# EasyEDA Pro project ProPrj_NavBot-ES02.epro, schematic MAIN

## Sheets
1 P1: Assembly Variant: Basic; Board Name: MAIN; Create Date: 2025-09-18; Page Name: P1; Project Name: NavBot-ES02; Schematic Name: MAIN; Update Date: 2025-10-18; BladeWidth: 10; Company: NavBot; Drawed: Xiaole; Page Size: A4; RegionStart: 1; Reviewed: Xiaole; ShowBorder: 1; TitleBlock: 1; TitleBlockPosition: 3; Version: V1.0; XRegionCount: 6; YRegionCount: 4
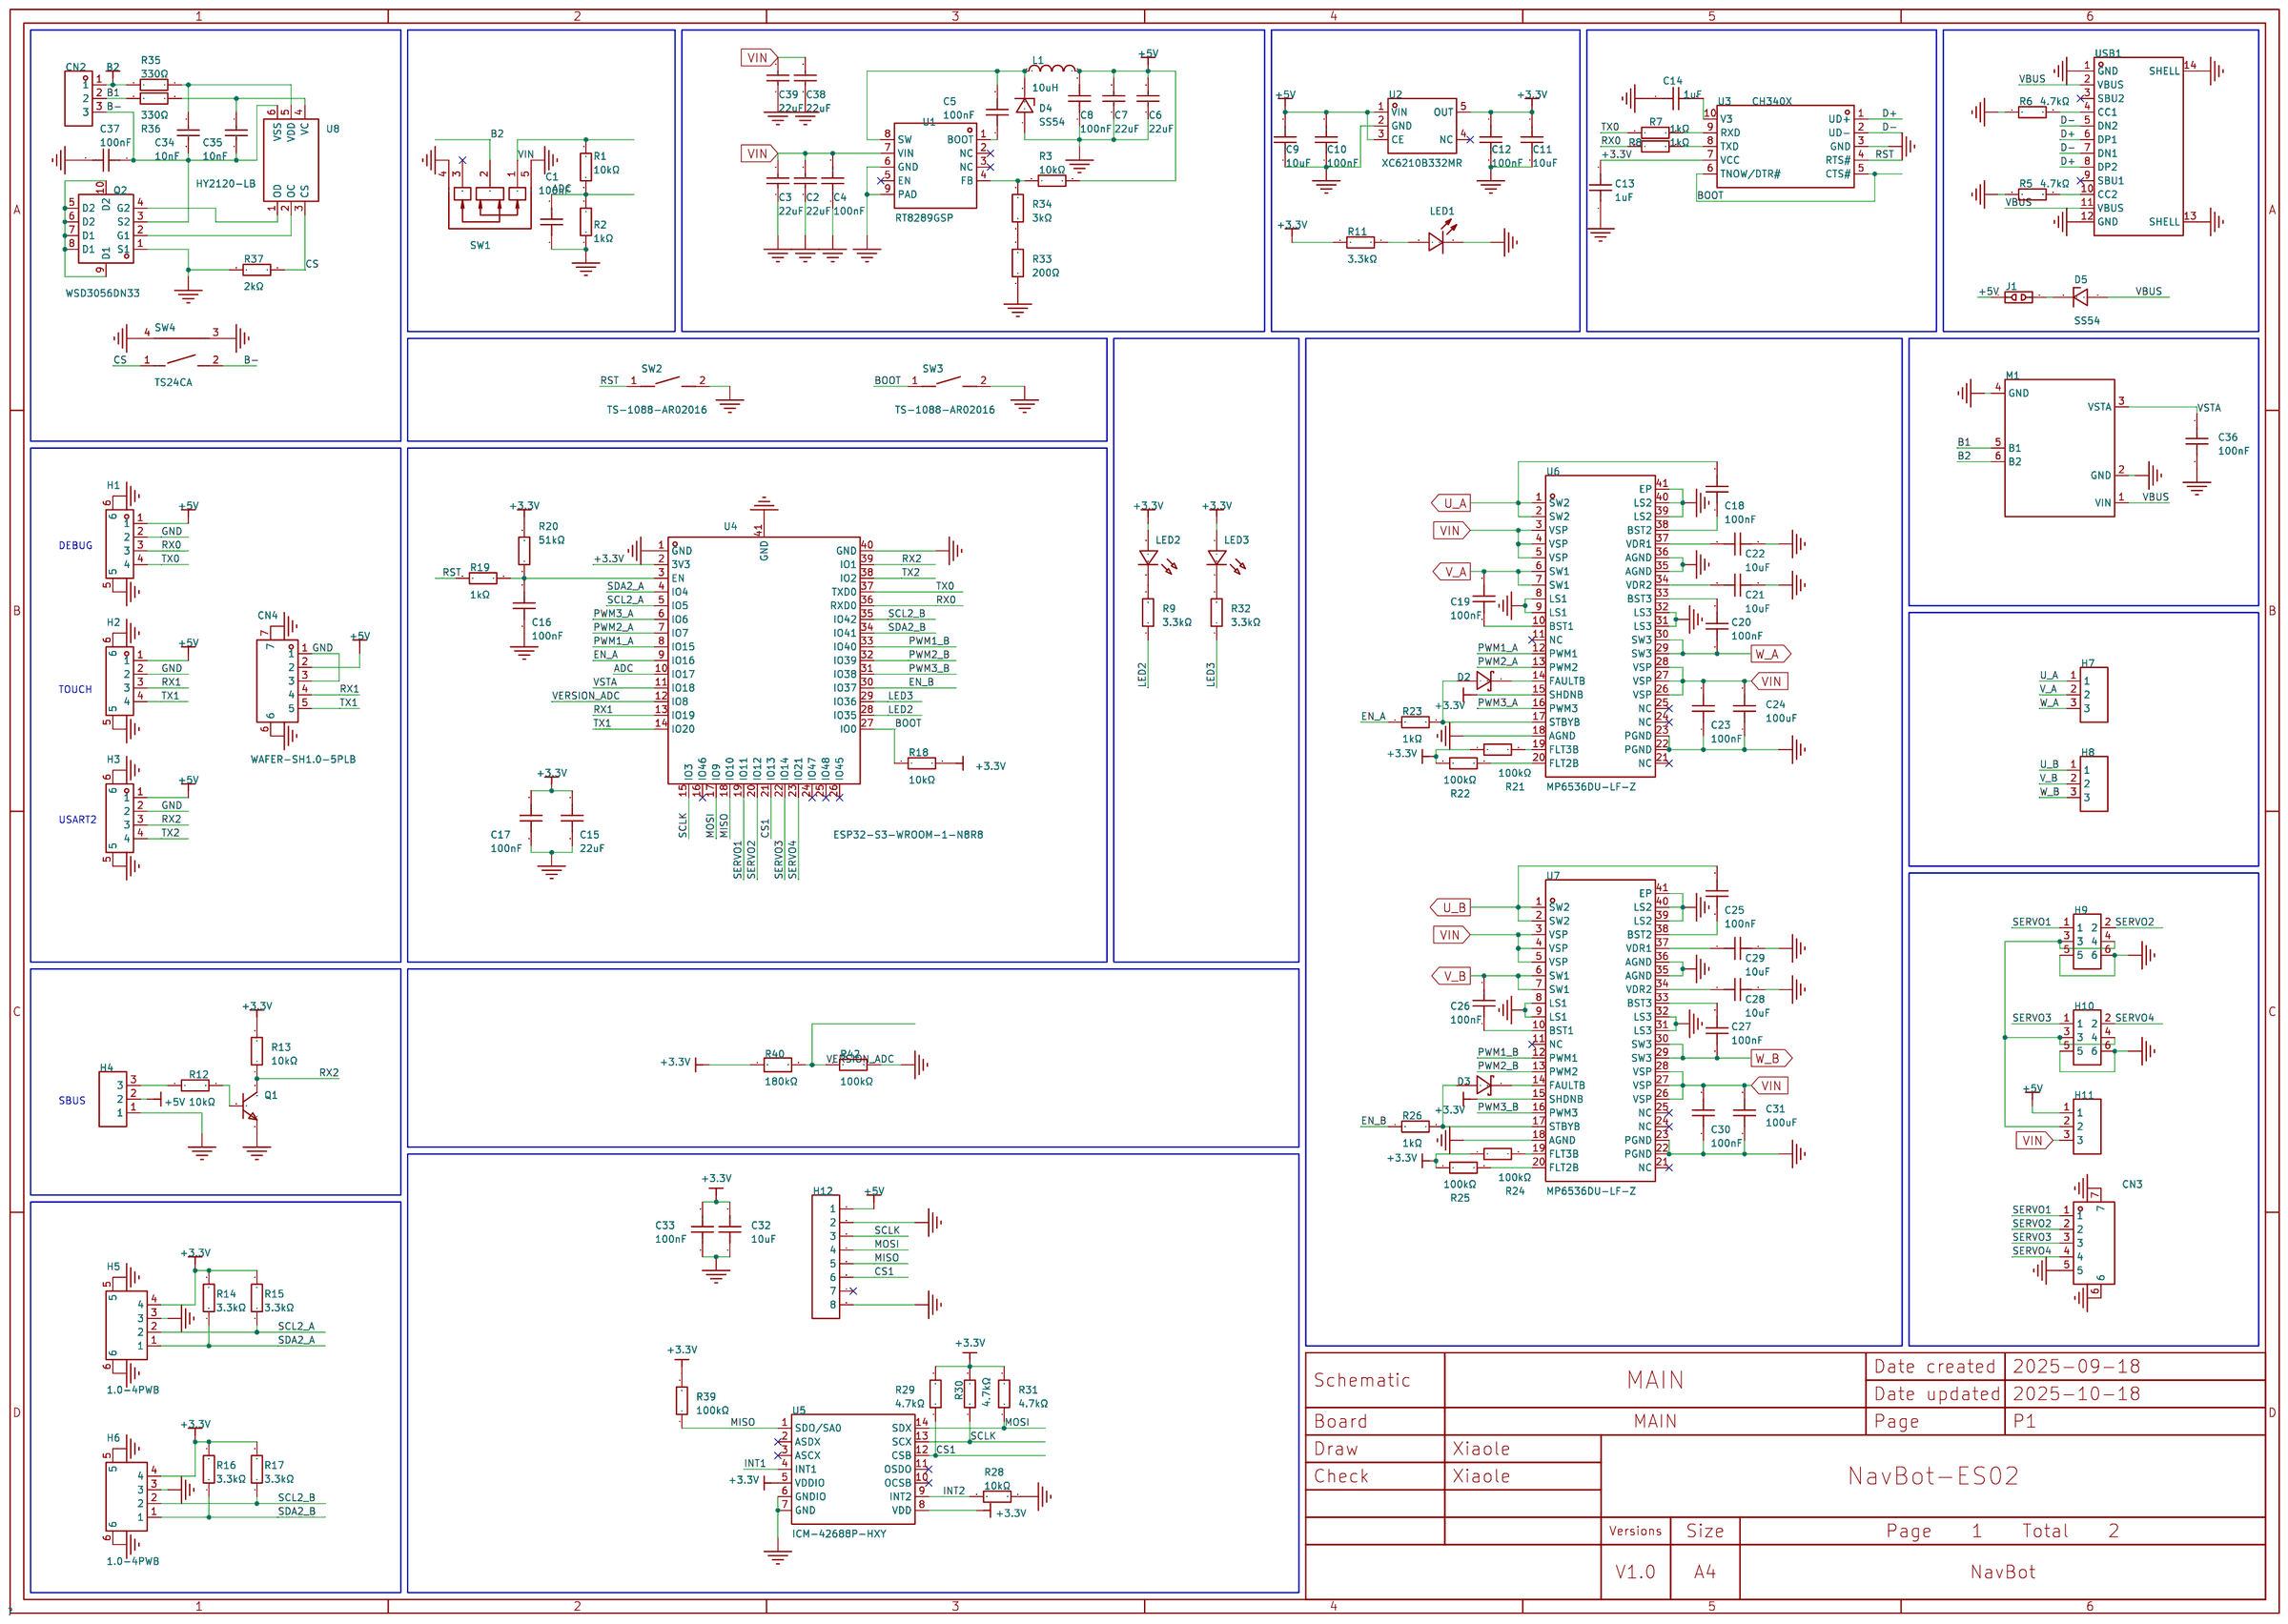
[diagram p1: P1]
2 VERSION: Create Date: 2025-10-11; Page Name: VERSION; Update Date: 2025-10-11
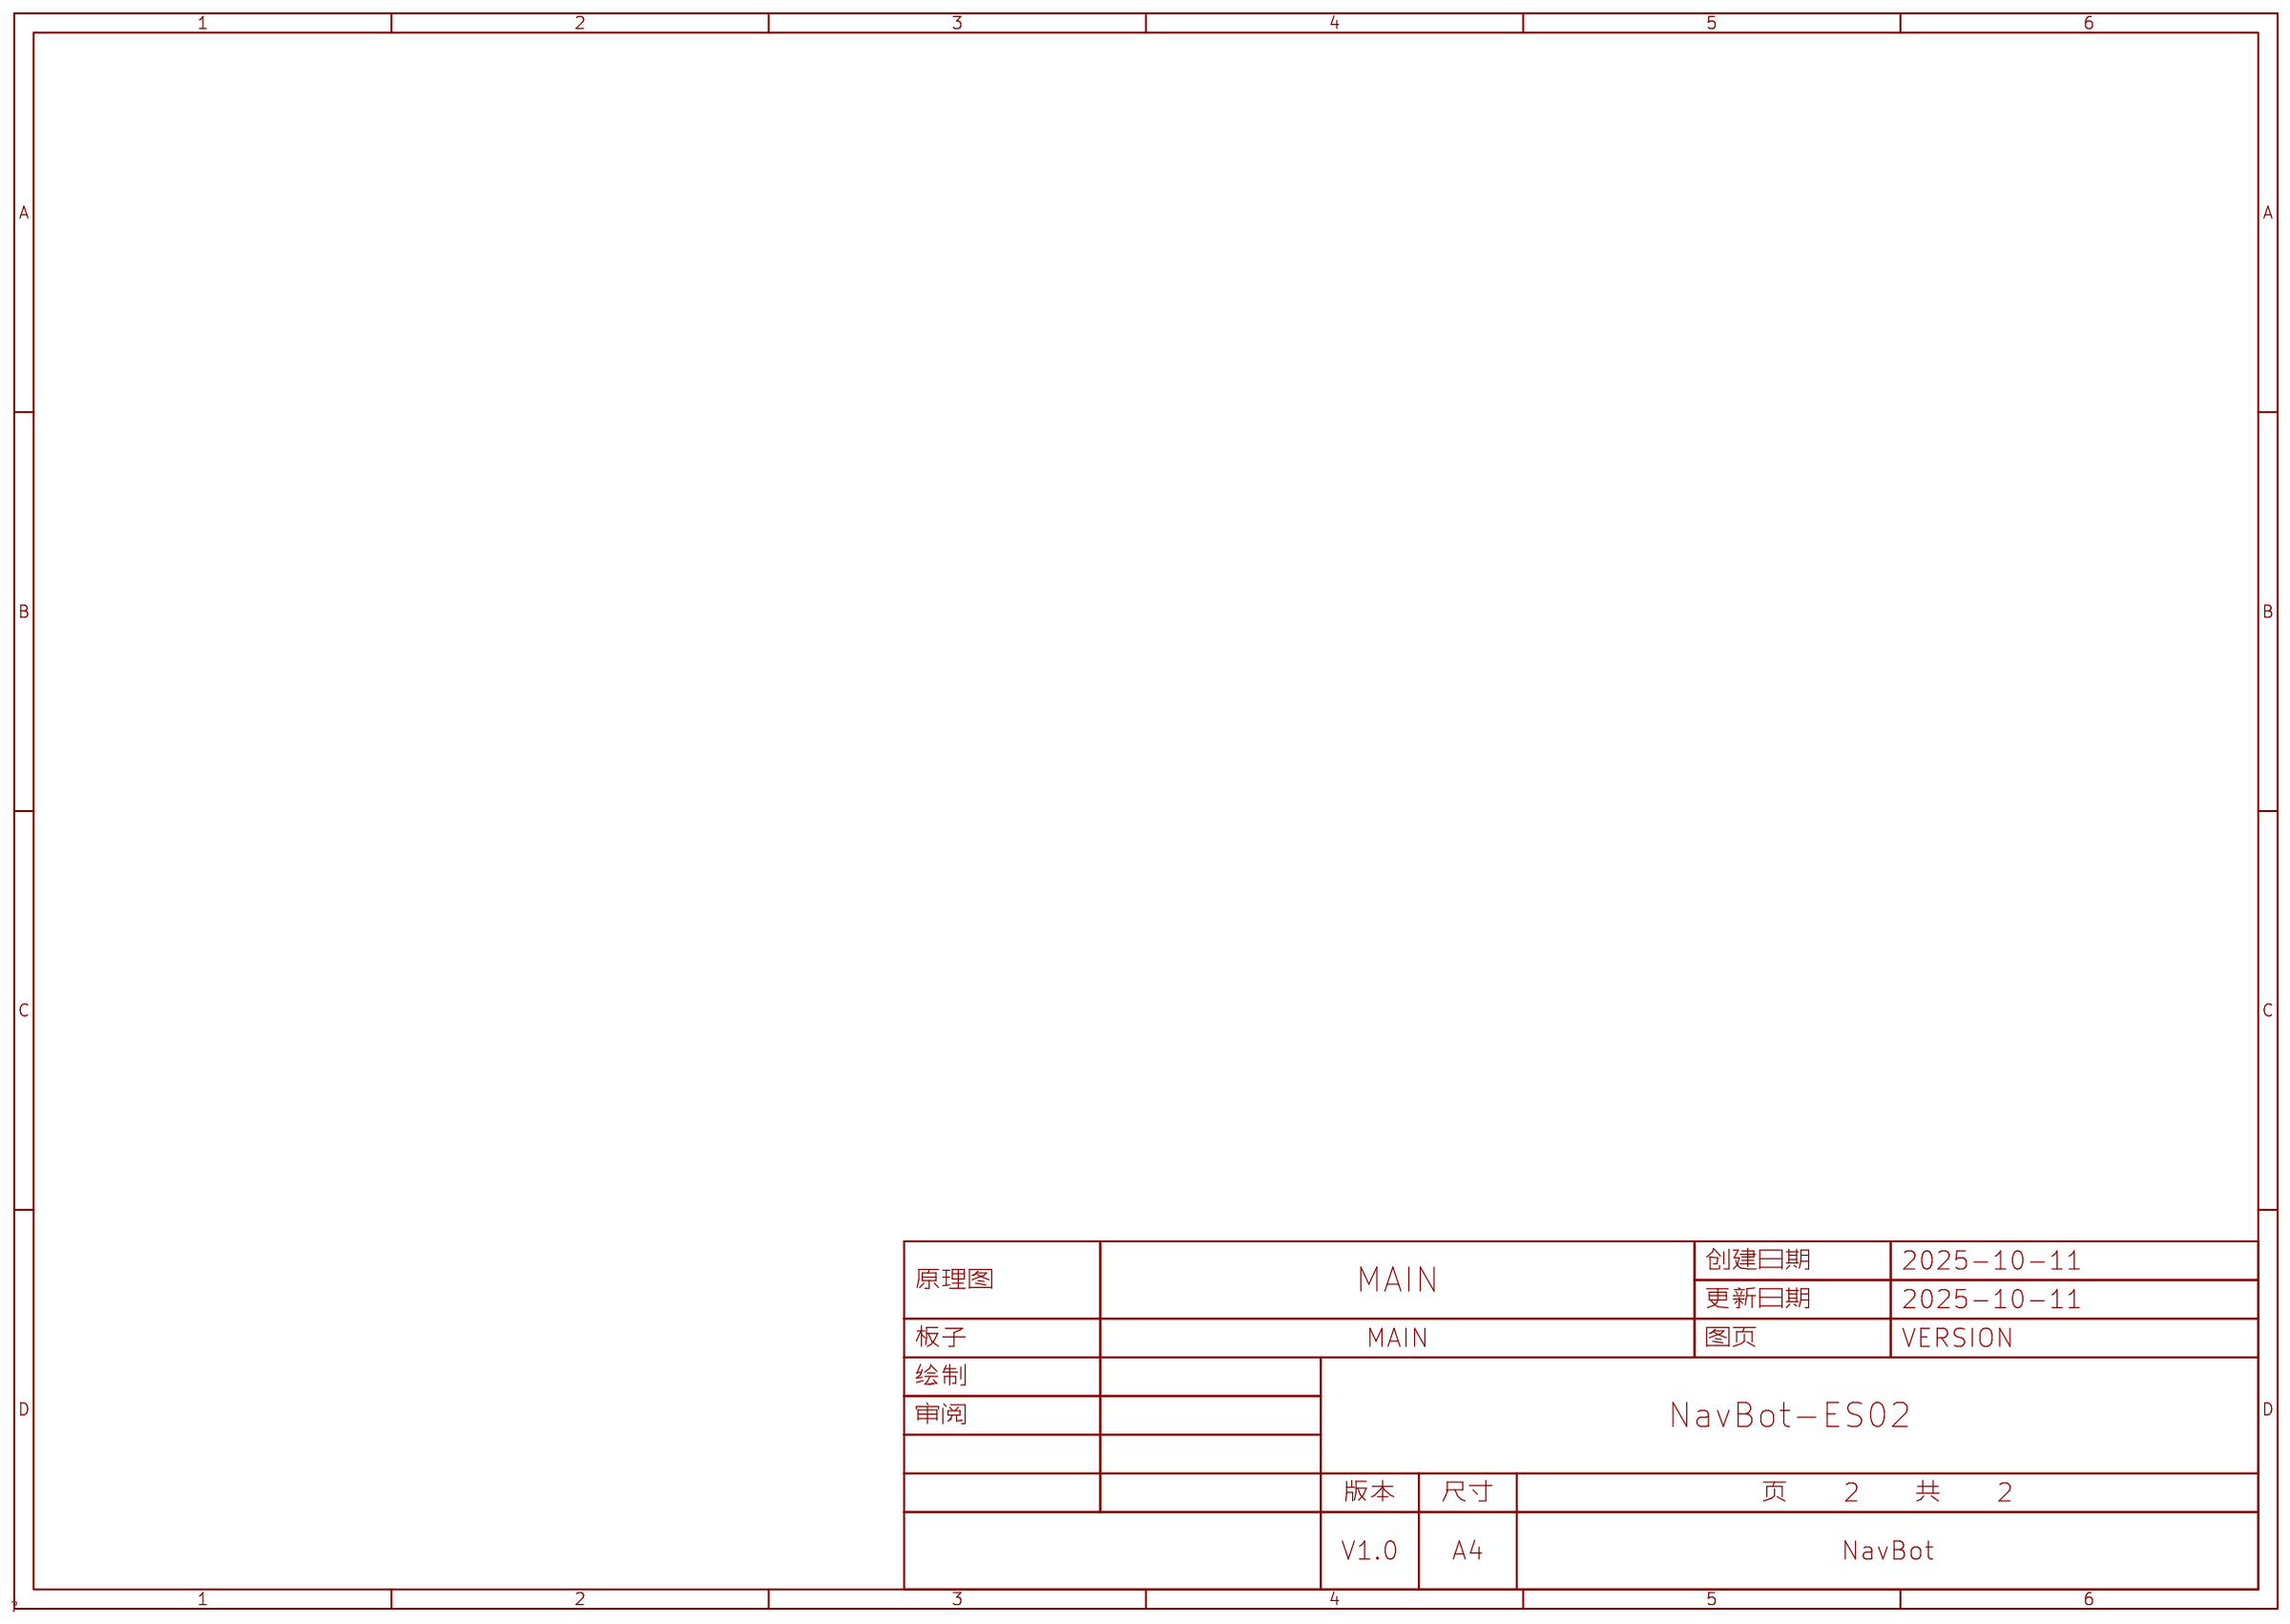
[diagram p2: VERSION]

## Parts
C1  100nF  [C0603]
C2  22uF  [C1206]
C3  22uF  [C1206]
C4  100nF  [C0603]
C5  100nF  [C0603]
C6  22uF  [C1206]
C7  22uF  [C1206]
C8  100nF  [C0603]
C9  10uF  [C0603]
C10  100nF  [C0603]
C11  10uF  [C0603]
C12  100nF  [C0603]
C13  1uF  [C0603]
C14  1uF  [C0603]
C15  22uF  [C0603]
C16  100nF  [C0603]
C17  100nF  [C0603]
C18  100nF  [C0603]
C19  100nF  [C0603]
C20  100nF  [C0603]
C21  10uF  [C0603]
C22  10uF  [C0603]
C23  100nF  [C0603]
C24  100uF  [C1206]
C25  100nF  [C0603]
C26  100nF  [C0603]
C27  100nF  [C0603]
C28  10uF  [C0603]
C29  10uF  [C0603]
C30  100nF  [C0603]
C31  100uF  [C1206]
C32  10uF  [C0603]
C33  100nF  [C0603]
C34  10nF  [C0603]
C35  10nF  [C0603]
C36  100nF  [C0603]
C37  100nF  [C0603]
C38  22uF  [C1206]
C39  22uF  [C1206]
CN2  HX25003-3WAP  [CONN-TH_3P-P2.50_HX25003-3WAP]
CN3  WAFER-SH1.0-5PLB  [CONN-SMD-5P-P1.00_BM05B-SRSS-TB-LF-SN]
CN4  WAFER-SH1.0-5PLB  [CONN-SMD-5P-P1.00_BM05B-SRSS-TB-LF-SN]
D2  SD103AWS  [SOD-323_L1.8-W1.3-LS2.5-RD]
D3  SD103AWS  [SOD-323_L1.8-W1.3-LS2.5-RD]
D4  SS54  [SMA_L4.3-W2.6-LS5.0-FD]
D5  SS54  [SMA_L4.3-W2.6-LS5.0-FD]
H1  WAFER-SH1.0-4PLB  [CONN-SMD_4P-P1.00-C3029334]
H2  WAFER-SH1.0-4PLB  [CONN-SMD_4P-P1.00-C3029334]
H3  WAFER-SH1.0-4PLB  [CONN-SMD_4P-P1.00-C3029334]
H4  PZ254R-11-03P  [HDR-TH_3P-P2.54-H-M-W10.4]
H5  1.0-4PWB  [CONN-SMD_4P-P1.00_DEALON_1.0-4PWB]
H6  1.0-4PWB  [CONN-SMD_4P-P1.00_DEALON_1.0-4PWB]
H7  PZ254R-11-03P  [HDR-TH_3P-P2.54-H-M-W10.4]
H8  PZ254R-11-03P  [HDR-TH_3P-P2.54-H-M-W10.4]
H9  PH2.54-07-03PWS  [HDR-TH_6P-P2.54-H-M-R2-C3-S2.54-W12.3-N]
H10  PH2.54-07-03PWS  [HDR-TH_6P-P2.54-H-M-R2-C3-S2.54-W12.3-N]
H11  PZ254R-11-03P  [HDR-TH_3P-P2.54-H-M-W10.4]
H12  -  [HDR-SMD_8P-P2.54-V-F-LS4.9]
J1  -  [0805短接点_FG]  (no BOM)
L1  10uH  [IND-SMD_L7.3-W6.8]
LED1  KT-0603R  [LED0603-RD]
LED2  -  [LED_0603]
LED3  -  [LED_0603]
M1  -  [2S充电模块]
Q1  SS8050(RANGE:200-350)  [SOT-23-3_L2.9-W1.3-P1.90-LS2.4-BR]
Q2  WSD3056DN33  [POWERPAK-SO-8_L3.0-W3.0-P0.65-BL]
R1  10kΩ  [R0603]
R2  1kΩ  [R0603]
R3  10kΩ  [R0603]
R5  4.7kΩ  [R0603]
R6  4.7kΩ  [R0603]
R7  1kΩ  [R0603]
R8  1kΩ  [R0603]
R9  3.3kΩ  [R0603]
R11  3.3kΩ  [R0603]
R12  10kΩ  [R0603]
R13  10kΩ  [R0603]
R14  3.3kΩ  [R0603]
R15  3.3kΩ  [R0603]
R16  3.3kΩ  [R0603]
R17  3.3kΩ  [R0603]
R18  10kΩ  [R0603]
R19  1kΩ  [R0603]
R20  51kΩ  [R0603]
R21  100kΩ  [R0603]
R22  100kΩ  [R0603]
R23  1kΩ  [R0603]
R24  100kΩ  [R0603]
R25  100kΩ  [R0603]
R26  1kΩ  [R0603]
R28  10kΩ  [R0603]
R29  4.7kΩ  [R0603]
R30  4.7kΩ  [R0603]
R31  4.7kΩ  [R0603]
R32  3.3kΩ  [R0603]
R33  200Ω  [R0603]
R34  3kΩ  [R0603]
R35  330Ω  [R0603]
R36  330Ω  [R0603]
R37  2kΩ  [R0603]
R39  100kΩ  [R0603]
R40  180kΩ  [R0603]
R42  100kΩ  [R0603]
SW1  SS-12D11G5R  [SW-TH_SS-12D11G5R]
SW2  TS-1088-AR02016  [SW-SMD_L3.9-W3.0-P4.45]
SW3  TS-1088-AR02016  [SW-SMD_L3.9-W3.0-P4.45]
SW4  TS24CA  [SW-SMD_2P-TS24CA]
U1  RT8289GSP  [SOIC-8_L5.0-W4.0-P1.27-LS6.0-BL-EP2.0]
U2  XC6210B332MR  [SOT-23-5_L2.9-W1.6-P0.95-LS2.8-BR]
U3  CH340X  [MSOP-10_L3.0-W3.0-P0.50-LS5.0-BL]
U4  ESP32-S3-WROOM-1-N8R8  [WIRELM-SMD_ESP32-S3-WROOM-1]
U5  ICM-42688P-HXY  [LGA-14_L3.0-W2.5-P0.50-TL]
U6  MP6536DU-LF-Z  [QFN-40_L5.0-W5.0-P0.40-TL-EP3.4]
U7  MP6536DU-LF-Z  [QFN-40_L5.0-W5.0-P0.40-TL-EP3.4]
U8  HY2120-LB  [SOT-23-6_L2.9-W1.6-P0.95-LS2.8-BR]
USB1  TYPE-C 16PIN 2MD(073)  [USB-C-SMD_TYPE-C-6PIN-2MD-073]

## Library data of the parts
C1 C4 C5 C8 C10 C12 C16-C20 C23 C25-C27 C30 C33 C36 C37 = CC0603KRX7R9BB104: 容值:100nF;精度:±10%;额定电压:50V;温度系数:X7R;; LCSC Part Name: 100nF ±10% 50V; Supplier Part: C14663; Manufacturer: YAGEO(国巨); Supplier Footprint: 0603; JLCPCB Part Class: 基础库; Datasheet: https://item.szlcsc.com/datasheet/CC0603KRX7R9BB104/15331.html; Supplier: LCSC; Tolerance: ±10%; Voltage Rating: 50V; Temperature Coefficient: X7R
C2 C3 C6 C7 C38 C39 = CL31A226KAHNNNE: 容值:22uF;精度:±10%;额定电压:25V;温度系数:X5R;; LCSC Part Name: 22uF ±10% 25V; Supplier Part: C12891; Manufacturer: SAMSUNG(三星); Supplier Footprint: 1206; JLCPCB Part Class: 基础库; Datasheet: https://item.szlcsc.com/datasheet/CL31A226KAHNNNE/13537.html; Supplier: LCSC; Tolerance: ±10%; Voltage Rating: 25V; Temperature Coefficient: X5R
C9 C11 C21 C22 C28 C29 = CL10A106MA8NRNC: 容值:10uF;精度:±20%;额定电压:25V;温度系数:X5R;; LCSC Part Name: 10uF ±20% 25V; Supplier Part: C96446; Manufacturer: SAMSUNG(三星); Supplier Footprint: 0603; JLCPCB Part Class: 基础库; Datasheet: https://item.szlcsc.com/datasheet/CL10A106MA8NRNC/97651.html; Supplier: LCSC; Tolerance: ±20%; Voltage Rating: 25V; Temperature Coefficient: X5R
C13 C14 = CL10A105KB8NNNC: 容值:1uF;精度:±10%;额定电压:50V;温度系数:X5R;; LCSC Part Name: 1uF ±10% 50V; Supplier Part: C15849; Manufacturer: SAMSUNG(三星); Supplier Footprint: 0603; JLCPCB Part Class: 基础库; Datasheet: https://item.szlcsc.com/datasheet/CL10A105KB8NNNC/16531.html; Supplier: LCSC; Tolerance: ±10%; Voltage Rating: 50V; Temperature Coefficient: X5R
C15 = CL10A226MQ8NRNC: 容值:22uF;精度:±20%;额定电压:6.3V;温度系数:X5R;; LCSC Part Name: 22uF ±20% 6.3V; Supplier Part: C59461; Manufacturer: SAMSUNG(三星); Supplier Footprint: 0603; JLCPCB Part Class: 基础库; Datasheet: https://item.szlcsc.com/datasheet/CL10A226MQ8NRNC/60514.html; Supplier: LCSC; Tolerance: ±20%; Voltage Rating: 6.3V; Temperature Coefficient: X5R
C24 C31 = HGC1206R5107M100NSPJ: 容值:100uF;精度:±20%;额定电压:10V;温度系数:X5R;; LCSC Part Name: 100uF ±20% 10V; Supplier Part: C7432784; Manufacturer: Chinocera(华瓷); Supplier Footprint: 1206; JLCPCB Part Class: 扩展库; Datasheet: https://atta.szlcsc.com/upload/public/pdf/source/20240320/FAC3FEC40A78BC5CCCE96C232A94D860.pdf; Supplier: LCSC; Tolerance: ±20%; Voltage Rating: 10V; Temperature Coefficient: X5R
C32 = CL10A106KP8NNNC: 容值:10uF;精度:±10%;额定电压:10V;温度系数:X5R;; LCSC Part Name: 10uF ±10% 10V; Supplier Part: C19702; Manufacturer: SAMSUNG(三星); Supplier Footprint: 0603; JLCPCB Part Class: 基础库; Datasheet: https://item.szlcsc.com/datasheet/CL10A106KP8NNNC/20411.html; Supplier: LCSC; Tolerance: ±10%; Voltage Rating: 10V; Temperature Coefficient: X5R
C34 C35 = 0603B103K500NT: 容值:10nF;精度:±10%;额定电压:50V;温度系数:X7R;; LCSC Part Name: 10nF ±10% 50V; Supplier Part: C57112; Manufacturer: FH(风华); Supplier Footprint: 0603; JLCPCB Part Class: 基础库; Datasheet: https://item.szlcsc.com/datasheet/0603B103K500NT/58143.html; Supplier: LCSC; Tolerance: ±10%; Voltage Rating: 50V; Temperature Coefficient: X7R
CN2 = HX25003-3WAP: Supplier: LCSC; Supplier Part: C442327; Manufacturer: HX(红星); JLCPCB Part Class: Extended Part
CN3 CN4 = WAFER-SH1.0-5PLB: 插针结构:1x5P;间距:1mm;安装方式:立贴;参考系列:SH;总PIN数:5P;排数:1;每排PIN数:5;行距:-;额定电流:1A;触头材质:黄铜;触头镀层:锡;工作温度:-40℃~+85℃;; LCSC Part Name: 1x5P 间距:1mm 立贴 系列:SH; Supplier Part: C3029335; Manufacturer: XUNPU(讯普); Supplier Footprint: SMD,P=1mm; JLCPCB Part Class: 扩展库; Datasheet: https://item.szlcsc.com/datasheet/WAFER-SH1.0-5PLB/3561347.html; Supplier: LCSC; Pins Structure: 1x5P; Pitch: 1mm; Mounting Type: 立贴; Reference Series: SH; Number of Pins: 5P; Number of Rows: 1; Number of PINs Per Row: 5; Current Rating: 1A; Contact Material: 黄铜; Contact Plating: 锡; Operating Temperature: -40℃~+85℃; Voltage Rating: 50V; Plastic Material: LCP; Supplementary Features: 辅助焊脚; Color: 米色; Z-Height of the Board: 4.4mm; X-Length of Bottom Edge on Board (Spacing Line): 7.35mm; Y-Width of Bottom Edge on Board: 3.05mm
D2 D3 = SD103AWS_C181207: 正向压降(Vf):600mV@200mA;直流反向耐压(Vr):40V;整流电流:350mA;; LCSC Part Name: 丝印S4 电压:40V 电流:350mA; Supplier Part: C181207; Manufacturer: Hottech(合科泰); Supplier Footprint: SOD-323; JLCPCB Part Class: 扩展库; Datasheet: https://item.szlcsc.com/datasheet/SD103AWS/192604.html; Supplier: LCSC; Voltage - Forward(Vf@If): 600mV@200mA; Voltage - DC Reverse(Vr): 40V; Current - Rectified: 350mA; Reverse Leakage Current (Ir): 5uA@30V; Non-Repetitive Peak Forward Surge Current: 2A
D4 D5 = SS54_C7420369: 二极管配置:独立式;正向压降(Vf):550mV@5.0A;直流反向耐压(Vr):40V;整流电流:5A;; LCSC Part Name: 电压:40V 电流:5A; Supplier Part: C7420369; Manufacturer: R+O(宏嘉诚); Supplier Footprint: SMA(DO-214AC); JLCPCB Part Class: 扩展库; Datasheet: https://item.szlcsc.com/datasheet/SS54/8397191.html; Supplier: LCSC; Diode Configuration: 独立式; Voltage - Forward(Vf@If): 550mV@5.0A; Voltage - DC Reverse(Vr): 40V; Current - Rectified: 5A; Reverse Leakage Current (Ir): 50uA@40V; Operating Junction Temperature Range: -55℃~+125℃; Non-Repetitive Peak Forward Surge Current: 120A
H1-H3 = WAFER-SH1.0-4PLB: 插针结构:1x4P;间距:1mm;安装方式:立贴;参考系列:SH;总PIN数:4P;排数:1;每排PIN数:4;行距:-;额定电流:1A;触头材质:黄铜;触头镀层:锡;工作温度:-40℃~+85℃;; LCSC Part Name: 1x4P 间距:1mm 立贴 系列:SH; Supplier Part: C3029334; Manufacturer: XUNPU(讯普); Supplier Footprint: SMD,P=1mm; JLCPCB Part Class: 扩展库; Datasheet: https://item.szlcsc.com/datasheet/WAFER-SH1.0-4PLB/3561346.html; Supplier: LCSC; Pins Structure: 1x4P; Pitch: 1mm; Mounting Type: 立贴; Reference Series: SH; Number of Pins: 4P; Number of Rows: 1; Number of PINs Per Row: 4; Current Rating: 1A; Contact Material: 黄铜; Contact Plating: 锡; Operating Temperature: -40℃~+85℃; Voltage Rating: 50V; Plastic Material: LCP; Supplementary Features: 辅助焊脚; Color: 米色; Z-Height of the Board: 4.4mm; X-Length of Bottom Edge on Board (Spacing Line): 6.35mm; Y-Width of Bottom Edge on Board: 3.05mm
H4 H7 H8 H11 = PZ254R-11-03P: 插针结构:1x3P;间距:2.54mm;行距:-;圆针/方针:方针;安装方式:弯插;排数:单排;总PIN位数:3P;额定电流:-;额定电压:-;配合针长度:6mm;塑高:2.5mm;触头材质:黄铜;触头镀层:-;工作温度:-40℃~+105℃;颜色:黑色;; LCSC Part Name: 1x3P 间距:2.54mm 方针 弯插; Supplier Part: C492411; Manufacturer: XFCN(兴飞); Supplier Footprint: 弯插,P=2.54mm; JLCPCB Part Class: 扩展库; Datasheet: https://item.szlcsc.com/datasheet/PZ254R-11-03P/502967.html; Supplier: LCSC; Pin Structure: 1x3P; Pitch: 2.54mm; Circluar Pins/Square Pins: 方针; Mounting Type: 弯插; Number of Rows: 单排; Number of Pins: 3P; Length of Mating Pin: 6mm; Insulation Height: 2.5mm; Contact Material: 黄铜; Operating Temperature: -40℃~+105℃; Color: 黑色
H5 H6 = 1.0-4PWB: 插针结构:1x4P;间距:1mm;安装方式:卧贴;参考系列:SH;总PIN数:4P;排数:1;每排PIN数:4;行距:-;额定电流:1A;触头材质:-;触头镀层:-;工作温度:-25℃~+85℃;; LCSC Part Name: 1x4P 间距:1mm 卧贴 系列:SH; Supplier Part: C2905006; Manufacturer: DEALON(德艺隆); Supplier Footprint: SMD,P=1mm,卧贴; JLCPCB Part Class: 扩展库; Datasheet: https://item.szlcsc.com/datasheet/1.0-4PWB/3172291.html; Supplier: LCSC; Pins Structure: 1x4P; Pitch: 1mm; Mounting Type: 卧贴; Reference Series: SH; Number of Pins: 4P; Number of Rows: 1; Number of PINs Per Row: 4; Current Rating: 1A; Operating Temperature: -25℃~+85℃; Voltage Rating: 50V; Supplementary Features: 辅助焊脚; Color: 米色; Z-Height of the Board: 2.9mm; X-Length of Bottom Edge on Board (Spacing Line): 6mm; Y-Width of Bottom Edge on Board: 5.03mm
H9 H10 = PH2.54-07-03PWS: 插针结构:2x3P;间距:2.54mm;圆针/方针:方针;安装方式:弯插;排数:双排;总PIN位数:6P;配合针长度:6mm;塑高:2.5mm;触头材质:黄铜;工作温度:-40℃~+105℃;颜色:黑色;; LCSC Part Name: 2x3P 间距:2.54mm 方针 弯插; Supplier Part: C7501617; Manufacturer: XUNPU(讯普); Supplier Footprint: 弯插,P=2.54mm; JLCPCB Part Class: 扩展库; Datasheet: https://item.szlcsc.com/datasheet/PH2.54-07-03PWS/8584171.html; Supplier: LCSC; Pin Structure: 2x3P; Pitch: 2.54mm; Circluar Pins/Square Pins: 方针; Mounting Type: 弯插; Number of Rows: 双排; Number of Pins: 6P; Length of Mating Pin: 6mm; Insulation Height: 2.5mm; Contact Material: 黄铜; Operating Temperature: -40℃~+105℃; Color: 黑色
H12 = HDR-F_2.54_1x8P: Supplier Part: C27438; Supplier Footprint: 插件
J1 = 0805短接点: Supplier Footprint: 0805; JLCPCB Part Class: Basic Part
L1 = FXL0630-100-M: 电感值:10uH;精度:±20%;额定电流:4.5A;饱和电流(Isat):5.5A;类型:一体成型电感;; LCSC Part Name: 10uH ±20% 5.5A; Supplier Part: C167223; Manufacturer: cjiang(长江微电); Supplier Footprint: SMD,6.6x7mm; JLCPCB Part Class: 扩展库; Datasheet: https://atta.szlcsc.com/upload/public/pdf/source/20240426/3189EA8206330E2108542F9E34E540E7.pdf; Supplier: LCSC; Tolerance: ±20%; Rated Current: 4.5A; Saturation Current (Isat): 5.5A; DC Resistance (DCR): 68mΩ; Type: 一体成型电感
LED1 = KT-0603R: 发光颜色:红色;功率:-;正向电流:-;主波长:-;二极管配置:-;透镜颜色:-;色温:-;发光角度:-;载带方式:-;工作温度:-40℃~+85℃;; LCSC Part Name: 0603 红灯 高亮; Supplier Part: C2286; Manufacturer: KENTO; Supplier Footprint: 0603; JLCPCB Part Class: 基础库; Datasheet: https://atta.szlcsc.com/upload/public/pdf/source/20160616/1466072038404.pdf; Supplier: LCSC; Emitted Color: 红色; Operating Temperature: -40℃~+85℃
LED2 LED3 = LED_0603-B: Supplier Footprint: 0603
M1 = 2S_RECHARGE
Q1 = SS8050(RANGE:200-350)_C2150: 晶体管类型:NPN;集电极电流(Ic):1.5A;集射极击穿电压(Vceo):25V;耗散功率(Pd):300mW;直流电流增益(hFE):200@800mA,1V;; LCSC Part Name: hfe=200~350 NPN 电流:1.5A 电压:25V; Supplier Part: C2150; Manufacturer: CJ(江苏长电/长晶); Supplier Footprint: SOT-23; JLCPCB Part Class: 基础库; Datasheet: https://item.szlcsc.com/datasheet/SS8050(RANGE%253A200-350)/2507.html; Supplier: LCSC; type: NPN; Current - Collector(Ic): 1.5A; Collector - Emitter Voltage VCEO: 25V; Pd - Power Dissipation: 300mW; DC Current Gain: 200@800mA,1V; Transition frequency(fT): 100MHz; Current - Collector Cutoff: 100nA; Vce Saturation(VCE(sat)): 500mV@800mA,80mA; Operating Temperature: -55℃~+150℃; Emitter-Base Voltage(Vebo): 5V; Number: 1个NPN
Q2 = WSD3056DN33: 数量:2个N沟道;漏源电压(Vdss):30V;连续漏极电流(Id):35A;导通电阻(RDS(on)):13mΩ@10V;耗散功率(Pd):27W;阈值电压(Vgs(th)):2.5V@250uA;; LCSC Part Name: 2个N沟道 耐压:30V 电流:35A; Supplier Part: C2758429; Manufacturer: WINSOK(微硕); Supplier Footprint: DFN-8(3x3); JLCPCB Part Class: 扩展库; Datasheet: https://item.szlcsc.com/datasheet/WSD3056DN33/2876928.html; Supplier: LCSC; Number: 2个N沟道; Drain to Source Voltage: 30V; Current - Continuous Drain(Id): 35A; RDS(on): 13mΩ@10V; Pd - Power Dissipation: 27W; Gate Threshold Voltage (Vgs(th)): 2.5V@250uA; Gate Charge(Qg): 7.2nC@10V; Input Capacitance(Ciss): 620pF; Reverse Transfer Capacitance (Crss@Vds): 30pF; Operating Temperature: -55℃~+150℃; Type: N沟道; Output Capacitance(Coss): 85pF
R1 R3 R12 R13 R18 R28 = 0603WAF1002T5E: 电阻类型:厚膜电阻;阻值:10kΩ;精度:±1%;功率:100mW;工作电压:75V;温度系数:±100ppm/℃;; LCSC Part Name: 厚膜电阻 10kΩ ±1% 100mW; Supplier Part: C25804; Manufacturer: UNI-ROYAL(厚声); Supplier Footprint: 0603; JLCPCB Part Class: 基础库; Datasheet: https://item.szlcsc.com/datasheet/0603WAF1002T5E/26547.html; Supplier: LCSC; Type: 厚膜电阻; Tolerance: ±1%; Power(Watts): 100mW; Voltage-Supply(Max): 75V; Temperature Coefficient: ±100ppm/℃; Operating Temperature: -55℃~+155℃
R2 R7 R8 R19 R23 R26 = 0603WAF1001T5E: 电阻类型:厚膜电阻;阻值:1kΩ;精度:±1%;功率:100mW;最大工作电压:75V;温度系数:±100ppm/℃;; LCSC Part Name: 1kΩ ±1% 100mW 厚膜电阻; Supplier Part: C21190; Manufacturer: UNI-ROYAL(厚声); Supplier Footprint: 0603; JLCPCB Part Class: Basic Part; Datasheet: https://atta.szlcsc.com/upload/public/pdf/source/20200306/C422600_1E6D84923E4A46A82E41ADD87F860B5C.pdf; Supplier: LCSC; Type: 厚膜电阻; Tolerance: ±1%; Power(Watts): 100mW; Overload Voltage (Max): 75V; Temperature Coefficient: ±100ppm/℃; Operating Temperature Range: -55℃~+155℃
R5 R6 R29-R31 = 0603WAF4701T5E: 电阻类型:厚膜电阻;阻值:4.7kΩ;精度:±1%;功率:100mW;工作电压:75V;温度系数:±100ppm/℃;; LCSC Part Name: 4.7kΩ ±1% 100mW 厚膜电阻; Supplier Part: C23162; Manufacturer: UNI-ROYAL(厚声); Supplier Footprint: 0603; JLCPCB Part Class: 基础库; Datasheet: https://item.szlcsc.com/datasheet/0603WAF4701T5E/23889.html; Supplier: LCSC; Type: 厚膜电阻; Tolerance: ±1%; Power(Watts): 100mW; Voltage-Supply(Max): 75V; Temperature Coefficient: ±100ppm/℃; Operating Temperature: -55℃~+155℃
R9 R11 R14-R17 R32 = 0603WAF3301T5E: 电阻类型:厚膜电阻;阻值:3.3kΩ;精度:±1%;功率:100mW;工作电压:75V;温度系数:±100ppm/℃;; LCSC Part Name: 3.3kΩ ±1% 100mW 厚膜电阻; Supplier Part: C22978; Manufacturer: UNI-ROYAL(厚声); Supplier Footprint: 0603; JLCPCB Part Class: 基础库; Datasheet: https://item.szlcsc.com/datasheet/0603WAF3301T5E/23705.html; Supplier: LCSC; Type: 厚膜电阻; Tolerance: ±1%; Power(Watts): 100mW; Voltage-Supply(Max): 75V; Temperature Coefficient: ±100ppm/℃; Operating Temperature: -55℃~+155℃
R20 = 0603WAF5102T5E: 电阻类型:厚膜电阻;阻值:51kΩ;精度:±1%;功率:100mW;工作电压:75V;温度系数:±100ppm/℃;; LCSC Part Name: 51kΩ ±1% 100mW 厚膜电阻; Supplier Part: C23196; Manufacturer: UNI-ROYAL(厚声); Supplier Footprint: 0603; JLCPCB Part Class: 基础库; Datasheet: https://item.szlcsc.com/datasheet/0603WAF5102T5E/23923.html; Supplier: LCSC; Type: 厚膜电阻; Tolerance: ±1%; Power(Watts): 100mW; Voltage-Supply(Max): 75V; Temperature Coefficient: ±100ppm/℃; Operating Temperature: -55℃~+155℃
R21 R22 R24 R25 R39 R42 = 0603WAF1003T5E: 电阻类型:厚膜电阻;阻值:100kΩ;精度:±1%;功率:100mW;工作电压:75V;温度系数:±100ppm/℃;; LCSC Part Name: 100kΩ ±1% 100mW 厚膜电阻; Supplier Part: C25803; Manufacturer: UNI-ROYAL(厚声); Supplier Footprint: 0603; JLCPCB Part Class: 基础库; Datasheet: https://item.szlcsc.com/datasheet/0603WAF1003T5E/26546.html; Supplier: LCSC; Type: 厚膜电阻; Tolerance: ±1%; Power(Watts): 100mW; Voltage-Supply(Max): 75V; Temperature Coefficient: ±100ppm/℃; Operating Temperature: -55℃~+155℃
R33 = 0603WAF2000T5E: 电阻类型:厚膜电阻;阻值:200Ω;精度:±1%;功率:100mW;最大工作电压:75V;温度系数:±100ppm/℃;; LCSC Part Name: 200Ω ±1% 100mW 厚膜电阻; Supplier Part: C8218; Manufacturer: UNI-ROYAL(厚声); Supplier Footprint: 0603; JLCPCB Part Class: 基础库; Datasheet: https://atta.szlcsc.com/upload/public/pdf/source/20200306/C422600_1E6D84923E4A46A82E41ADD87F860B5C.pdf; Supplier: LCSC; Type: 厚膜电阻; Tolerance: ±1%; Power(Watts): 100mW; Overload Voltage (Max): 75V; Temperature Coefficient: ±100ppm/℃; Operating Temperature Range: -55℃~+155℃
R34 = 0603WAF3001T5E: 电阻类型:厚膜电阻;阻值:3kΩ;精度:±1%;功率:100mW;工作电压:75V;温度系数:±100ppm/℃;; LCSC Part Name: 3kΩ ±1% 100mW 厚膜电阻; Supplier Part: C4211; Manufacturer: UNI-ROYAL(厚声); Supplier Footprint: 0603; JLCPCB Part Class: 基础库; Datasheet: https://item.szlcsc.com/datasheet/0603WAF3001T5E/4618.html; Supplier: LCSC; Type: 厚膜电阻; Tolerance: ±1%; Power(Watts): 100mW; Voltage-Supply(Max): 75V; Temperature Coefficient: ±100ppm/℃; Operating Temperature: -55℃~+155℃
R35 R36 = 0603WAF3300T5E: 电阻类型:厚膜电阻;阻值:330Ω;精度:±1%;功率:100mW;最大工作电压:75V;温度系数:±100ppm/℃;; LCSC Part Name: 330Ω ±1% 100mW 厚膜电阻; Supplier Part: C23138; Manufacturer: UNI-ROYAL(厚声); Supplier Footprint: 0603; JLCPCB Part Class: 基础库; Datasheet: https://atta.szlcsc.com/upload/public/pdf/source/20200306/C422600_1E6D84923E4A46A82E41ADD87F860B5C.pdf; Supplier: LCSC; Type: 厚膜电阻; Tolerance: ±1%; Power(Watts): 100mW; Overload Voltage (Max): 75V; Temperature Coefficient: ±100ppm/℃; Operating Temperature Range: -55℃~+155℃
R37 = 0603WAF2001T5E: 电阻类型:厚膜电阻;阻值:2kΩ;精度:±1%;功率:100mW;工作电压:75V;温度系数:±100ppm/℃;; LCSC Part Name: 2kΩ ±1% 100mW 厚膜电阻; Supplier Part: C22975; Manufacturer: UNI-ROYAL(厚声); Supplier Footprint: 0603; JLCPCB Part Class: 基础库; Datasheet: https://item.szlcsc.com/datasheet/0603WAF2001T5E/23702.html; Supplier: LCSC; Type: 厚膜电阻; Tolerance: ±1%; Power(Watts): 100mW; Voltage-Supply(Max): 75V; Temperature Coefficient: ±100ppm/℃; Operating Temperature: -55℃~+155℃
R40 = FRC0603F1803TS: 电阻类型:厚膜电阻;阻值:180kΩ;精度:±1%;功率:100mW;工作电压:75V;温度系数:±100ppm/℃;; LCSC Part Name: 180kΩ ±1% 100mW 厚膜电阻; Supplier Part: C2906999; Manufacturer: FOJAN(富捷); Supplier Footprint: 0603; JLCPCB Part Class: 扩展库; Supplier: LCSC; Type: 厚膜电阻; Tolerance: ±1%; Power(Watts): 100mW; Voltage-Supply(Max): 75V; Temperature Coefficient: ±100ppm/℃; Operating Temperature: -55℃~+155℃
SW1 = SS-12D11G5R: 电路结构:单刀双掷;安装方式:弯插;开关颜色:黑色;额定电流:3A;额定电压:125V;工作寿命:1万次;; LCSC Part Name: 柄长5mm 弯插双档 滑动开关; Supplier Part: C388633; Manufacturer: XKB Connection(中国星坤); Supplier Footprint: 插件; JLCPCB Part Class: 扩展库; Datasheet: https://item.szlcsc.com/datasheet/SS-12D11G5R/363903.html; Supplier: LCSC; Circuit: 单刀双掷; Actuator Style: 矩形柱状; Termination Style: PC引脚; Mounting Type: 弯插; Actuator Color: 黑色; Current Rating: 3A; Voltage Rating: 125V; Life: 1万次; Operating Temperature: -40℃~+85℃
SW2 SW3 = TS-1088-AR02016: 电路结构:单刀单掷;按钮形状:圆形按钮;作用力:1.6N;安装方式:立贴;开关长度:4mm;开关宽度:3mm;开关高度:2mm;带支架:不带支架;触点电流:50mA;额定电压:12V;工作寿命:10万次;; LCSC Part Name: 4*3*2mm 立贴 轻触开关; Supplier Part: C720477; Manufacturer: XUNPU(讯普); Supplier Footprint: SMD; JLCPCB Part Class: 基础库; Datasheet: https://item.szlcsc.com/datasheet/TS-1088-AR02016/763484.html; Supplier: LCSC; Circuit: 单刀单掷; Actuator Style: 圆形按钮; Operating Force: 1.6N; Mounting Type: 立贴; Length: 4mm; Width: 3mm; Switch Height: 2mm; with Bracket: 不带支架; Contact Current: 50mA; Voltage Rating: 12V; Actuator/Cap Color: 黑色; Termination Style: SMD接片; Life: 10万次; Operating Temperature: -30℃~+80℃
SW4 = TS24CA: 电路结构:单刀单掷;按钮形状:矩形按钮;安装方式:卧贴;开关长度:4.55mm;开关宽度:1.8mm;开关高度:3.5mm;触点电流:50mA;额定电压:12V;带灯:-;工作寿命:-;; LCSC Part Name: 4.55*1.8*3.5mm 卧贴 轻触开关; Supplier Part: C393942; Manufacturer: SHOU HAN(首韩); Supplier Footprint: SMD,4.6x1.8mm; JLCPCB Part Class: 扩展库; Datasheet: https://item.szlcsc.com/datasheet/TS24CA/372554.html; Supplier: LCSC; Circuit: 单刀单掷; Actuator Style: 矩形按钮; Mounting Type: 卧贴; Length: 4.55mm; Width: 1.8mm; Switch Height: 3.5mm; Contact Current: 50mA; Voltage Rating: 12V
U1 = RT8289GSP: 功能类型:降压型;输出类型:可调;工作电压:5.5V~32V;输出电压:1.222V~26V;输出电流:5A;; LCSC Part Name: 5A 32V 500kHz 降压转换器; Supplier Part: C39202; Manufacturer: RICHTEK(立锜); Supplier Footprint: SOIC-8-EP; JLCPCB Part Class: 扩展库; Datasheet: https://atta.szlcsc.com/upload/public/pdf/source/20141219/1457707253176.pdf; Supplier: LCSC; Function: 降压型; Output Type: 可调; Voltage - Supply: 5.5V~32V; Output Voltage: 1.222V~26V; Output Current: 5A; Frequency - Switching: 500kHz; Operating Temperature: -40℃~+125℃; Synchronous Rectifier: 否; Number of Outputs: 1; Topology: 降压式; Quiescent Current: 25uA; Switch tube (built-in/external): 内置
U2 = XC6210B332MR: LCSC Part Name: Higt PSRR Voltage Regulator; Supplier Part: C3021084; Manufacturer: TECH PUBLIC(台舟); Supplier Footprint: SOT-23-5; JLCPCB Part Class: 扩展库; Datasheet: https://atta.szlcsc.com/upload/public/pdf/source/20220524/E0126CADD4FAB104D4B88A5F9575F61A.pdf; Supplier: LCSC
U3 = CH340X: 应用功能:USB转串口；USB转并口;USB协议版本:USB 2.0;通道数:-;数据速率:2Mbps;; Supplier Part: C3035748; Manufacturer: WCH(南京沁恒); Supplier Footprint: MSOP-10; JLCPCB Part Class: 扩展库; Datasheet: https://item.szlcsc.com/datasheet/CH340X/3584030.html; Supplier: LCSC; Applications Function: USB转串口；USB转并口; USB Protocol: USB 2.0; Voltage - Supply: 3.3V；5V; Data Rate: 2Mbps; Operating Temperature: -40℃~+85℃
U4 = ESP32-S3-WROOM-1-N8R8: Supplier Part: C2913201; Manufacturer: ESPRESSIF(乐鑫); Supplier Footprint: SMD,25.5x18mm; JLCPCB Part Class: 扩展库; Datasheet: https://item.szlcsc.com/datasheet/ESP32-S3-WROOM-1-N8R8/3198299.html; Supplier: LCSC
U5 = ICM-42688P-HXY: 此款姿态传感器集成了加速度计与陀螺仪，支持X、Y、Z三轴检测，能够精确感知设备在空间中的定位及运动状态。其工作电压范围宽达1.71V至3.6V，适应性强，可在-40℃到+85℃的温度范围内稳定工作，适用于各种环境条件下的电子设备中。该传感器为智能设备的姿态控制、运动跟踪以及方向识别提供了精准的数据支持，是提升用户体验和实现复杂互动功能的关键组件。; Supplier Part: C46550687; Manufacturer: HXY MOSFET(华轩阳电子); Supplier Footprint: LGA-14(2.5x3); JLCPCB Part Class: 扩展库; Datasheet: https://item.szlcsc.com/datasheet/ICM-42688P-HXY/48681527.html; Supplier: LCSC
U6 U7 = MP6536DU-LF-Z: 无刷电机驱动，25V~48V供电，4A~6A方案，; Supplier Part: C3655732; Manufacturer: MPS(芯源); Supplier Footprint: QFN-40(5x5); JLCPCB Part Class: 扩展库; Datasheet: https://atta.szlcsc.com/upload/public/pdf/source/20240407/07DD85C3643347AFA136924CF8D0835E.pdf; Supplier: LCSC; Output Current: 5.5A; Peak Current: 5.5A; RDS(on): 140mΩ; Operating Temperature: -40℃~+125℃
U8 = HY2120-LB: 工作电压:1.5V~10V;电池类型:锂离子/聚合物;电池节数:2;; LCSC Part Name: 双节锂离子/锂聚合物电池组保护IC; Supplier Part: C168778; Manufacturer: HYCON(宏康); Supplier Footprint: SOT-23-6; JLCPCB Part Class: 扩展库; Datasheet: https://item.szlcsc.com/datasheet/HY2120-LB/180162.html; Supplier: LCSC; The Chip Type: 保护芯片; Voltage - Supply: 1.5V~10V; Charging Saturation Voltage: 4.25V; End-Off Voltage: 2.8V; Type of Battery: 锂离子/聚合物; Number of Cells: 2; Operating Temperature: -40℃~+85℃; 0V Battery Charge: 支持; Supply Current (Iq): 100nA
USB1 = TYPE-C 16PIN 2MD(073): 连接器类型:Type-C;协议标准:-;公母:母;安装方式:卧贴;触点数量:16P;端口数量:1;额定电流 - 电源:3A;工作温度:-25℃~+85℃;; LCSC Part Name: Type-C 母 卧贴; Supplier Part: C2765186; Manufacturer: SHOU HAN(首韩); Supplier Footprint: SMD; JLCPCB Part Class: 扩展库; Datasheet: https://item.szlcsc.com/datasheet/TYPE-C%252016PIN%25202MD(073)/2901843.html; Supplier: LCSC; Connector Type: Type-C; Gender: 母; Mounting Type: 卧贴; Number of Contacts: 16P; Number of Ports: 1; Current Rating-Power: 3A; Voltage Rating: 5V; Connect-Disconnect Life: 5千次; Detection color: 黑色; Operating Temperature: -25℃~+85℃

## Nets
+3.3V: C11.1 C12.1 C13.2 C15.1 C17.2 C32.2 C33.2 H5.4 H6.4 LED2.2(A) LED3.2(A) R11.2 R13.2 R14.2 R15.2 R16.2 R17.2 R18.2 R20.2 R21.1 R22.1 R24.1 R25.1 R29.2 R30.2 R31.2 R39.2 R40.1 U2.5(OUT) U3.7(VCC) U4.2(3V3) U5.5(VDDIO) U5.8(VDD) U6.15(SHDNB) U7.15(SHDNB)
+5V: C6.2 C7.2 C8.2 C9.2 C10.2 CN4.2 H1.1 H2.1 H3.1 H4.2 H11.1 H12.1 J1.1 L1.2 R3.2 U2.1(VIN) U2.3(CE)
GND: C1.1 C2.1 C3.1 C4.1 C6.1 C7.1 C8.1 C9.1 C10.1 C11.2 C12.2 C13.1 C14.1 C15.2 C16.1 C17.1 C21.2 C22.2 C23.1 C24.1 C28.2 C29.2 C30.1 C31.1 C32.1 C33.1 C36.2 C37.2 C38.1 C39.1 CN3.5 CN3.6 CN3.7 CN4.1 CN4.3 CN4.6 CN4.7 D4.1(A) H1.2 H1.5 H1.6 H2.2 H2.5 H2.6 H3.2 H3.5 H3.6 H4.1 H5.3 H5.5 H5.6 H6.3 H6.5 H6.6 H9.5 H9.6 H10.5 H10.6 H12.2 H12.8 LED1.1(K) M1.2(GND) M1.4(GND) Q1.2(E) Q2.1(S1) R2.1 R5.1 R6.1 R28.1 R33.1 R37.1 R42.2 SW1.4 SW1.5 SW2.2 SW3.2 SW4.3 SW4.4 U1.6(GND) U1.9(PAD) U2.2(GND) U3.3(GND) U4.1(GND) U4.40(GND) U4.41(GND) U5.6(GNDIO) U5.7(GND) U6.8(LS1) U6.9(LS1) U6.18(AGND) U6.22(PGND) U6.23(PGND) U6.31(LS3) U6.32(LS3) U6.35(AGND) U6.36(AGND) U6.39(LS2) U6.40(LS2) U6.41(EP) U7.8(LS1) U7.9(LS1) U7.18(AGND) U7.22(PGND) U7.23(PGND) U7.31(LS3) U7.32(LS3) U7.35(AGND) U7.36(AGND) U7.39(LS2) U7.40(LS2) U7.41(EP) USB1.1(GND) USB1.12(GND) USB1.13(SHELL) USB1.14(SHELL)
VBUS: D5.1(A) M1.1(VIN) USB1.2(VBUS) USB1.11(VBUS)
VIN: C2.2 C3.2 C4.2 C23.2 C24.2 C30.2 C31.2 C38.2 C39.2 H11.3 R1.2 SW1.1 U1.7(VIN) U6.3(VSP) U6.4(VSP) U6.5(VSP) U6.26(VSP) U6.27(VSP) U6.28(VSP) U7.3(VSP) U7.4(VSP) U7.5(VSP) U7.26(VSP) U7.27(VSP) U7.28(VSP)
ADC: C1.2 R1.1 R2.2 U4.10(IO17)
B1: CN2.2 M1.5(B1) R36.1
B2: CN2.1 M1.6(B2) R35.1 SW1.2
B-: C34.1 C35.1 C37.1 CN2.3 Q2.3(S2) SW4.2 U8.6(VSS)
BOOT: R18.1 SW3.1 U3.5(CTS#) U3.6(TNOW/DTR#) U4.27(IO0)
CS: R37.2 SW4.1 U8.3(CS)
CS1: H12.6 R29.1 U4.21(IO13) U5.12(CSB)
D+: U3.1(UD+) USB1.6(DP1) USB1.8(DP2)
D-: U3.2(UD-) USB1.5(DN2) USB1.7(DN1)
EN_A: R23.1 U4.9(IO16)
EN_B: R26.1 U4.30(IO37)
INT1: U5.4(INT1)
INT2: R28.2 U5.9(INT2)
LED2: R9.1 U4.28(IO35)
LED3: R32.1 U4.29(IO36)
MISO: H12.5 R39.1 U4.18(IO10) U5.1(SDO/SA0)
MOSI: H12.4 R31.1 U4.17(IO9) U5.14(SDX)
PWM1_A: U4.8(IO15) U6.12(PWM1)
PWM1_B: U4.33(IO40) U7.12(PWM1)
PWM2_A: U4.7(IO7) U6.13(PWM2)
PWM2_B: U4.32(IO39) U7.13(PWM2)
PWM3_A: U4.6(IO6) U6.16(PWM3)
PWM3_B: U4.31(IO38) U7.16(PWM3)
RST: R19.2 SW2.1 U3.4(RTS#)
RX0: H1.3 R8.1 U4.36(RXD0)
RX1: CN4.4 H2.3 U4.13(IO19)
RX2: H3.3 Q1.3(C) R13.1 U4.39(IO1)
SCL2_A: H5.2 R15.1 U4.5(IO5)
SCL2_B: H6.2 R17.1 U4.35(IO42)
SCLK: H12.3 R30.1 U4.15(IO3) U5.13(SCX)
SDA2_A: H5.1 R14.1 U4.4(IO4)
SDA2_B: H6.1 R16.1 U4.34(IO41)
SERVO1: CN3.1 H9.1 U4.19(IO11)
SERVO2: CN3.2 H9.2 U4.20(IO12)
SERVO3: CN3.3 H10.1 U4.22(IO14)
SERVO4: CN3.4 H10.2 U4.23(IO21)
TX0: H1.4 R7.1 U4.37(TXD0)
TX1: CN4.5 H2.4 U4.14(IO20)
TX2: H3.4 U4.38(IO2)
U_A: C18.2 H7.1 U6.1(SW2) U6.2(SW2)
U_B: C25.2 H8.1 U7.1(SW2) U7.2(SW2)
V_A: C19.2 H7.2 U6.6(SW1) U6.7(SW1)
V_B: C26.2 H8.2 U7.6(SW1) U7.7(SW1)
VERSION_ADC: R40.2 R42.1 U4.12(IO8)
VSTA: C36.1 M1.3(VSTA) U4.11(IO18)
W_A: C20.1 H7.3 U6.29(SW3) U6.30(SW3)
W_B: C27.1 H8.3 U7.29(SW3) U7.30(SW3)
$1N2260: R3.1 R34.2 U1.4(FB)
$1N2389: C5.1 U1.1(BOOT)
$1N2414: C5.2 D4.2(K) L1.1 U1.8(SW)
$1N3025: R5.2 USB1.10(CC2)
$1N3041: R6.2 USB1.4(CC1)
$1N3674: C14.2 U3.10(V3)
$1N3733: R7.2 U3.9(RXD)
$1N3813: R8.2 U3.8(TXD)
$1N3996: LED1.2(A) R11.1
$1N4673: C16.2 R19.1 R20.1 U4.3(EN)
$1N5206: LED2.1(C) R9.2
$1N8578: Q1.1(B) R12.2
$1N8581: H4.3 R12.1
$1N10550: H9.3 H9.4 H10.3 H10.4 H11.2
$1N10925: C18.1 U6.38(BST2)
$1N11051: C19.1 U6.10(BST1)
$1N11092: C20.2 U6.33(BST3)
$1N11138: C21.1 U6.34(VDR2)
$1N11195: C22.1 U6.37(VDR1)
$1N13944: R22.2 U6.20(FLT2B)
$1N13948: R21.2 U6.19(FLT3B)
$1N13984: D2.1(C) U6.14(FAULTB)
$1N14018: D2.2(A) R23.2 U6.17(STBYB)
$1N14887: C25.1 U7.38(BST2)
$1N14892: C26.1 U7.10(BST1)
$1N14893: C27.2 U7.33(BST3)
$1N14895: C28.1 U7.34(VDR2)
$1N14897: C29.1 U7.37(VDR1)
$1N14906: R25.2 U7.20(FLT2B)
$1N14908: R24.2 U7.19(FLT3B)
$1N14914: D3.1(C) U7.14(FAULTB)
$1N14916: D3.2(A) R26.2 U7.17(STBYB)
$1N18308: LED3.1(C) R32.2
$1N24341: R33.2 R34.1
$1N30381: D5.2(K) J1.2
$1N31293: Q2.5(D2) Q2.6(D2) Q2.7(D1) Q2.8(D1) Q2.9(D1) Q2.10(D2)
$1N42515: Q2.4(G2) U8.1(OD)
$1N42523: Q2.2(G1) U8.2(OC)
$1N46033: C34.2 R35.2 U8.5(VDD)
$1N46092: C35.2 R36.2 U8.4(VC)

Not connected (* = marked no-connect by the designer): H12 7*; SW1 3*; U1 2(NC)* 3(NC)* 5(EN)*; U2 4(NC)*; U4 16(IO46)* 24(IO47)* 25(IO48)* 26(IO45)*; U5 2(ASDX)* 3(ASCX)* 10(OCSB)* 11(OSDO)*; U6 11(NC)* 21(NC)* 24(NC)* 25(NC)*; U7 11(NC)* 21(NC)* 24(NC)* 25(NC)*; USB1 3(SBU2)* 9(SBU1)*

## Notes on the sheets
sheet 1
- DEBUG
- TOUCH
- USART2
- SBUS
